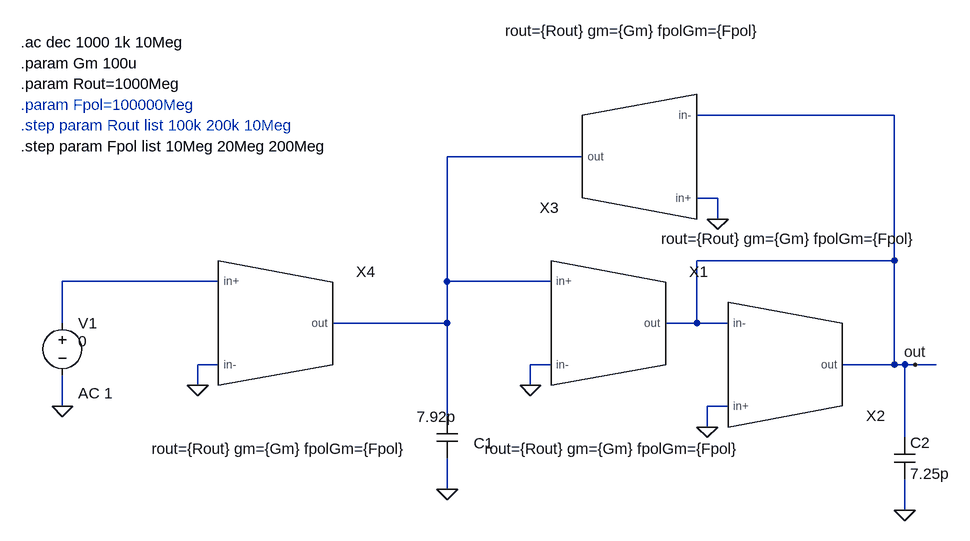
[diagram p0: schematic tb_TowThomas_Gm_model.asc]
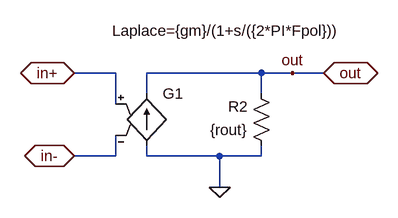
[diagram p1: sub-circuit gm_model.asc]
tb_TowThomas_Gm_model.asc, the LTspice schematic file:
Version 4
SHEET 1 2760 1708
WIRE 1696 -160 1392 -160
WIRE 1216 -96 1008 -96
WIRE 1424 -32 1392 -32
WIRE 1424 0 1424 -32
WIRE 1696 64 1696 -160
WIRE 1696 64 1392 64
WIRE 656 96 416 96
WIRE 1008 96 1008 -96
WIRE 1168 96 1008 96
WIRE 416 160 416 96
WIRE 1008 160 1008 96
WIRE 1008 160 832 160
WIRE 1392 160 1392 64
WIRE 1392 160 1344 160
WIRE 1440 160 1392 160
WIRE 656 224 624 224
WIRE 1168 224 1136 224
WIRE 1696 224 1696 64
WIRE 1696 224 1616 224
WIRE 1712 224 1696 224
WIRE 1728 224 1712 224
WIRE 1760 224 1728 224
WIRE 624 256 624 224
WIRE 1136 256 1136 224
WIRE 416 288 416 240
WIRE 1440 288 1408 288
WIRE 1008 304 1008 160
WIRE 1408 320 1408 288
WIRE 1712 336 1712 224
WIRE 1008 416 1008 368
WIRE 1712 448 1712 400
FLAG 416 288 0
FLAG 1728 224 out
FLAG 1712 448 0
FLAG 1008 416 0
FLAG 1136 256 0
FLAG 1408 320 0
FLAG 1424 0 0
FLAG 624 256 0
DATAFLAG 1552 64 ""
SYMBOL voltage 416 144 R0
WINDOW 123 24 124 Left 2
WINDOW 39 0 0 Left 2
WINDOW 3 24 44 Left 2
SYMATTR Value2 AC 1
SYMATTR Value 0
SYMATTR InstName V1
SYMBOL cap 992 304 R0
WINDOW 3 -31 0 Left 2
WINDOW 0 57 41 Left 2
SYMATTR Value 7.92p
SYMATTR InstName C1
SYMBOL cap 1696 336 R0
SYMATTR InstName C2
SYMATTR Value 7.25p
SYMBOL Gm_model 1392 144 R0
WINDOW 39 -128 225 Bottom 2
SYMATTR SpiceLine rout={Rout} gm={Gm} fpolGm={Fpol}
SYMATTR InstName X1
SYMBOL Gm_model 1664 240 M180
WINDOW 39 -128 225 Bottom 2
SYMATTR SpiceLine rout={Rout} gm={Gm} fpolGm={Fpol}
SYMATTR InstName X2
SYMBOL Gm_model 1168 -80 R180
WINDOW 39 -128 225 Bottom 2
SYMATTR SpiceLine rout={Rout} gm={Gm} fpolGm={Fpol}
SYMATTR InstName X3
SYMBOL Gm_model 880 144 R0
WINDOW 39 -128 225 Bottom 2
SYMATTR SpiceLine rout={Rout} gm={Gm} fpolGm={Fpol}
SYMATTR InstName X4
TEXT 352 -272 Left 2 !.ac dec 1000 1k 10Meg
TEXT 352 -240 Left 2 !.param Gm 100u
TEXT 352 -208 Left 2 !.param Rout=1000Meg
TEXT 352 -176 Left 2 ;.param Fpol=100000Meg
TEXT 352 -144 Left 2 ;.step param Rout list 100k 200k 10Meg
TEXT 352 -112 Left 2 !.step param Fpol list 10Meg 20Meg 200Meg

gm_model.asc, the sub-circuit schematic file:
Version 4
SHEET 1 2564 1736
WIRE 1248 208 1184 208
WIRE 1472 208 1296 208
WIRE 1520 208 1472 208
WIRE 1568 208 1520 208
WIRE 1296 240 1296 208
WIRE 1472 240 1472 208
WIRE 1248 256 1248 208
WIRE 1248 336 1248 304
WIRE 1248 336 1184 336
WIRE 1296 336 1296 320
WIRE 1408 336 1296 336
WIRE 1472 336 1472 320
WIRE 1472 336 1408 336
WIRE 1408 384 1408 336
FLAG 1520 208 out
FLAG 1568 208 out
IOPIN 1568 208 BiDir
FLAG 1184 208 in+
IOPIN 1184 208 BiDir
FLAG 1184 336 in-
IOPIN 1184 336 BiDir
FLAG 1408 384 0
SYMBOL g 1296 224 R0
WINDOW 3 -53 -81 Left 2
SYMATTR Value Laplace={gm}/(1+s/({2*PI*Fpol}))
SYMATTR InstName G1
SYMBOL res 1488 336 R180
WINDOW 0 36 76 Left 2
WINDOW 3 36 40 Left 2
SYMATTR InstName R2
SYMATTR Value {rout}

The netlist it stands for:
* tb_TowThomas_Gm_model.asc
V1 N002 0 0 AC 1
C1 N001 0 7.92p
C2 out 0 7.25p
XX1 N001 0 out gm_model params: rout={Rout} gm={Gm} fpolGm={Fpol}
XX2 0 out out gm_model params: rout={Rout} gm={Gm} fpolGm={Fpol}
XX3 0 out N001 gm_model params: rout={Rout} gm={Gm} fpolGm={Fpol}
XX4 N002 0 N001 gm_model params: rout={Rout} gm={Gm} fpolGm={Fpol}

* block symbol definitions
.subckt gm_model in+ in- out
G1 0 out in+ in- Laplace={gm}/(1+s/({2*PI*Fpol}))
R2 0 out {rout}
.ends gm_model

.ac dec 1000 1k 10Meg
.param Gm 100u
.param Rout=1000Meg
* .param Fpol=100000Meg
* .step param Rout list 100k 200k 10Meg
.step param Fpol list 10Meg 20Meg 200Meg
.backanno
.end